# Altium schematic sheet Upper.SchDoc
size A4; SheetNumber: 1; SheetTotal: 2
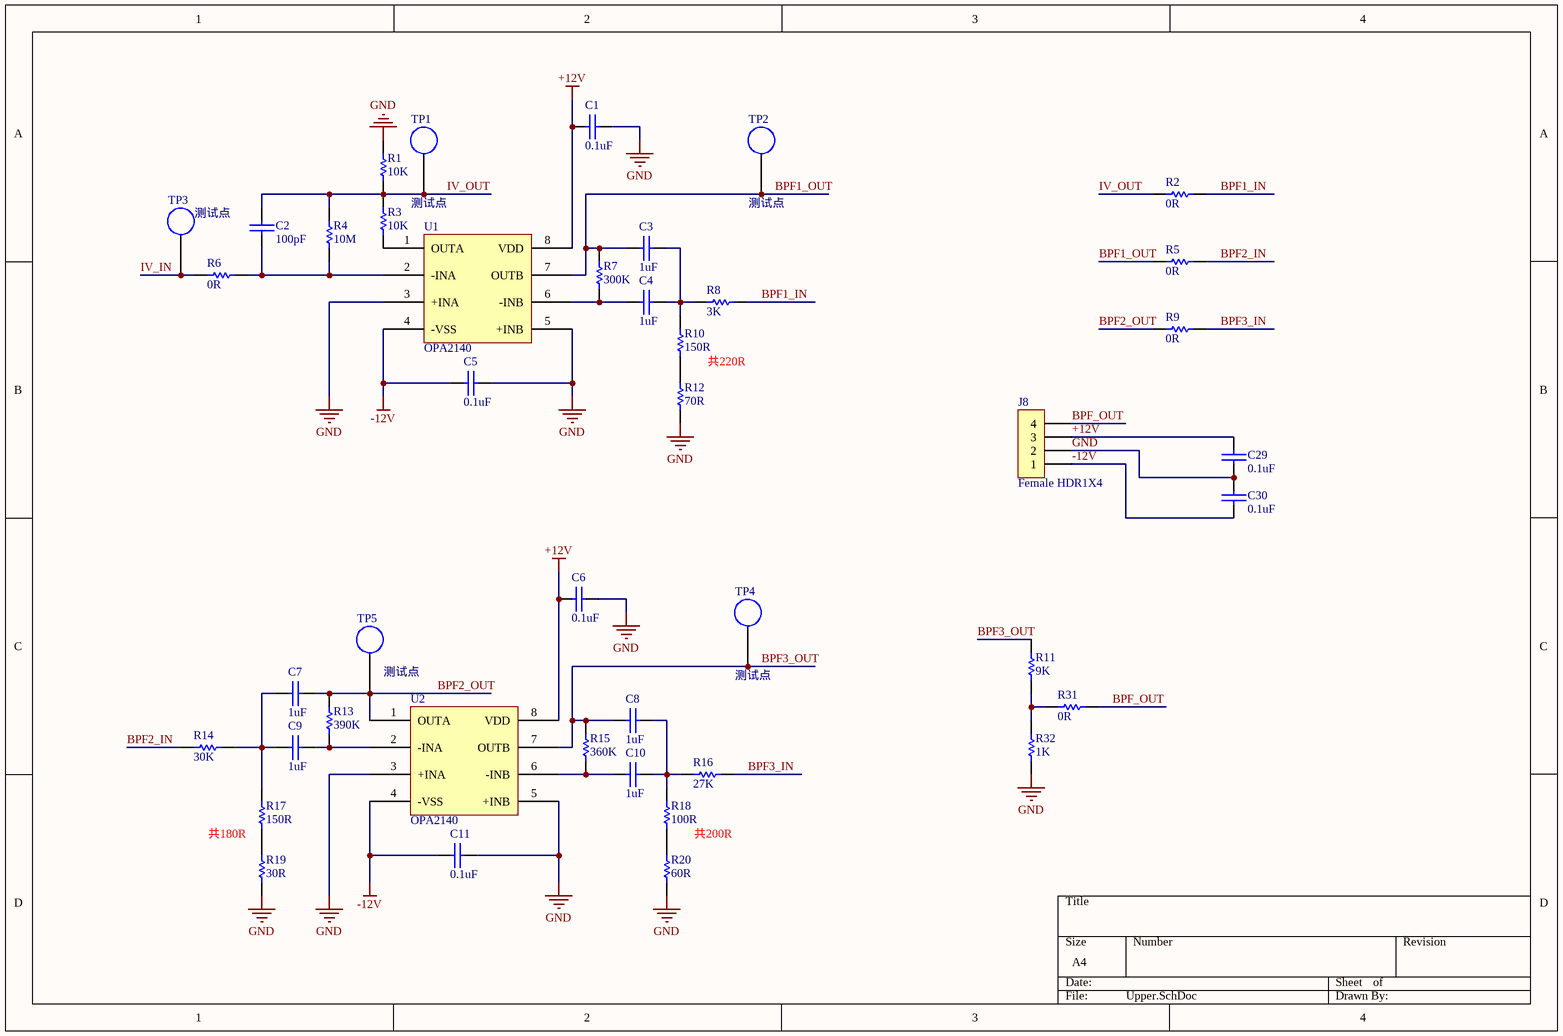
[diagram p0: Upper.SchDoc]

## Parts
C1  0.1uF  [0603C]
C2  100pF  [0603C]
C3  1uF  [0603C]
C4  1uF  [0603C]
C5  0.1uF  [0603C]
C6  0.1uF  [0603C]
C7  1uF  [1206C]
C8  1uF  [0603C]
C9  1uF  [1206C]
C10  1uF  [0603C]
C11  0.1uF  [0603C]
C29  0.1uF  [0603C]
C30  0.1uF  [0603C]
J8  Female HDR1X4  [Fe-HDR1X4/2.54-S]
R1  10K  [0603R]
R2  0R  [0603R]
R3  10K  [0603R]
R4  10M  [0603R]
R5  0R  [0603R]
R6  0R  [0603R]
R7  300K  [0603R]
R8  3K  [0603R]
R9  0R  [0603R]
R10  150R  [0603R]
R11  9K  [0603R]
R12  70R  [0603R]
R13  390K  [0603R]
R14  30K  [0603R]
R15  360K  [0603R]
R16  27K  [0603R]
R17  150R  [0603R]
R18  100R  [0603R]
R19  30R  [0603R]
R20  60R  [0603R]
R31  0R  [0603R]
R32  1K  [0603R]
TP1  测试点  [TP]
TP2  测试点  [TP]
TP3  测试点  [TP]
TP4  测试点  [TP]
TP5  测试点  [TP]
U1  OPA2140  [SOP8]
U2  OPA2140  [SOP8]

## Nets
+12V: C1.1 C6.1 C29.2 J8.3 U1.8(VDD) U2.8(VDD)
-12V: C5.1 C11.1 C30.1 J8.1 U1.4(-VSS) U2.4(-VSS)
GND: C1.2 C5.2 C6.2 C11.2 C29.1 C30.2 J8.2 R1.2 R12.2 R19.2 R20.2 R32.1 U1.3(+INA) U1.5(+INB) U2.3(+INA) U2.5(+INB)
BPF1_IN: R2.2 R8.1
BPF1_OUT: C3.2 R5.1 R7.2 TP2.1(TP) U1.7(OUTB)
BPF2_IN: R5.2 R14.2
BPF2_OUT: C7.1 R9.1 R13.2 TP5.1(TP) U2.1(OUTA)
BPF3_IN: R9.2 R16.1
BPF3_OUT: C8.2 R11.2 R15.2 TP4.1(TP) U2.7(OUTB)
BPF_OUT: J8.4 R31.1
IV_IN: R6.2 TP3.1(TP)
IV_OUT: C2.1 R1.1 R2.1 R3.2 R4.2 TP1.1(TP)
NetC2_2: C2.2 R4.1 R6.1 U1.2(-INA)
NetC3_1: C3.1 C4.2 R8.2 R10.1
NetC4_1: C4.1 R7.1 U1.6(-INB)
NetC7_2: C7.2 C9.1 R14.1 R17.1
NetC8_1: C8.1 C10.2 R16.2 R18.1
NetC9_2: C9.2 R13.1 U2.2(-INA)
NetC10_1: C10.1 R15.1 U2.6(-INB)
NetR3_1: R3.1 U1.1(OUTA)
NetR10_2: R10.2 R12.1
NetR11_1: R11.1 R31.2 R32.2
NetR17_2: R17.2 R19.1
NetR18_2: R18.2 R20.1

## Notes on the sheet
- 共220R
- 共180R
- 共200R

## Library data of the parts
C1-C11 C29 C30 = CAP: 无极性电容
R1-R20 R31 R32 = RES
U1 U2 = NE5532